# Altium schematic sheet tinybord.SchDoc
size A4
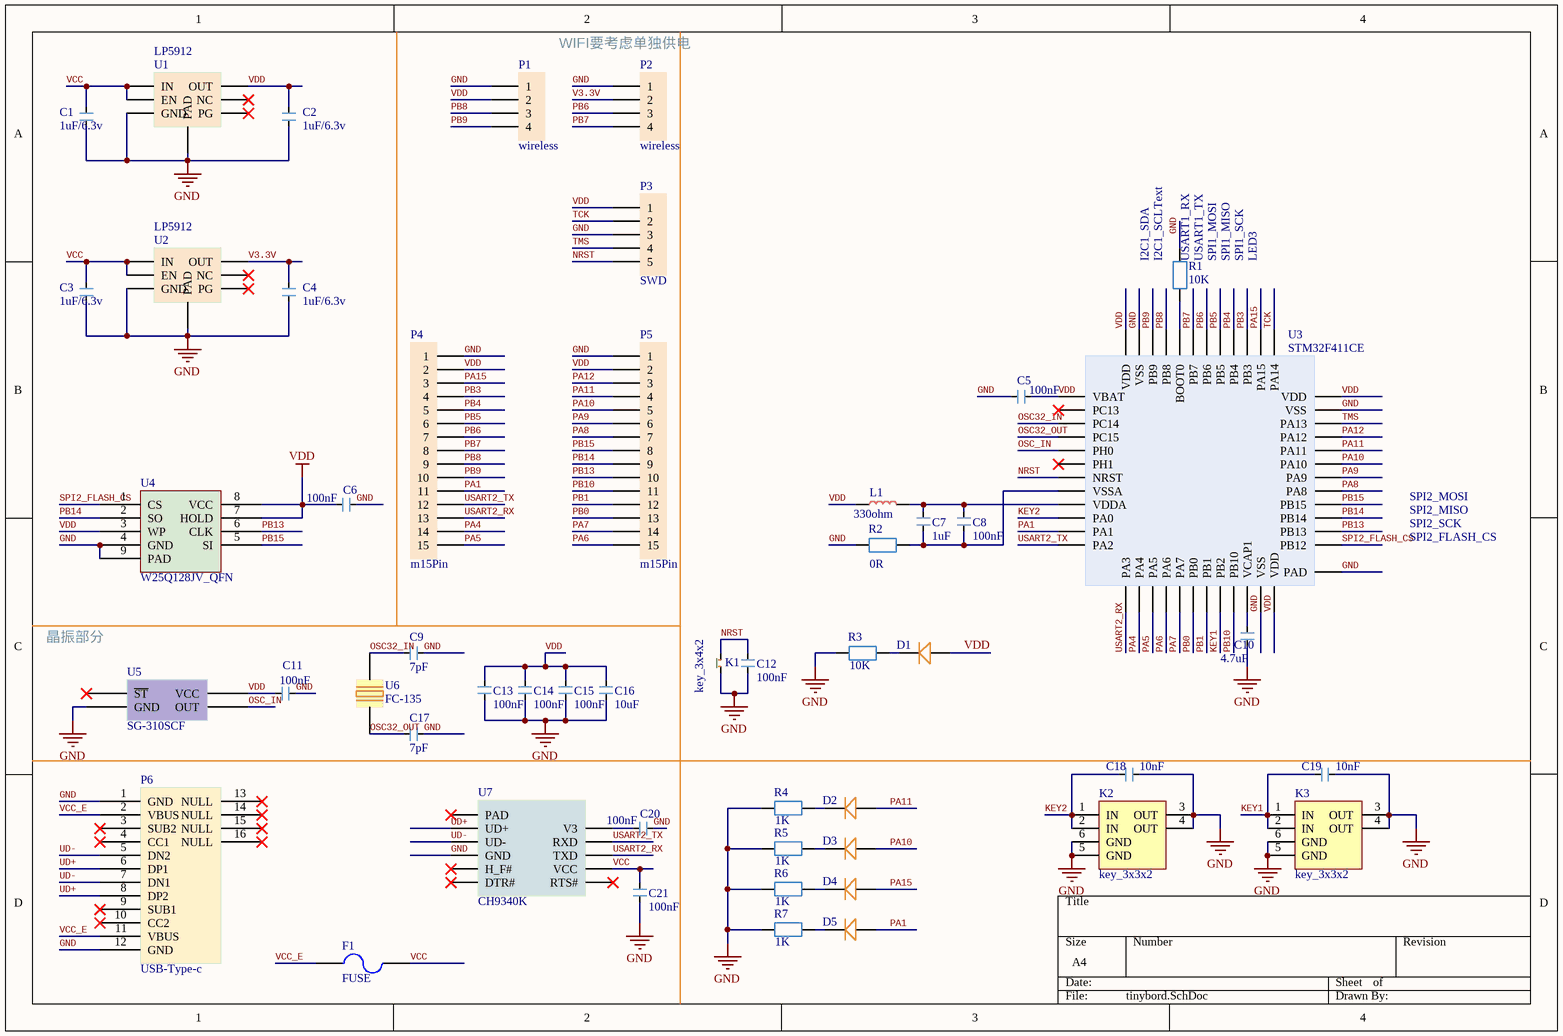
[diagram p0: tinybord.SchDoc]

## Parts
C1  value 1uF/6.3v  [C0603]  (hidden comment: C0603)
C2  value 1uF/6.3v  [C0603]  (hidden comment: C0603)
C3  value 1uF/6.3v  [C0603]  (hidden comment: C0603)
C4  value 1uF/6.3v  [C0603]  (hidden comment: C0603)
C5  value 100nF  [C0603]  (hidden comment: C0603)
C6  value 100nF  [C0603]  (hidden comment: C0603)
C7  value 1uF  [C0603]  (hidden comment: C0603)
C8  value 100nF  [C0603]  (hidden comment: C0603)
C9  value 7pF  [C0603]  (hidden comment: C0603)
C10  value 4.7uF  [C0603]  (hidden comment: C0603)
C11  value 100nF  [C0603]  (hidden comment: C0603)
C12  value 100nF  [C0603]  (hidden comment: C0603)
C13  value 100nF  [C0603]  (hidden comment: C0603)
C14  value 100nF  [C0603]  (hidden comment: C0603)
C15  value 100nF  [C0603]  (hidden comment: C0603)
C16  value 10uF  [C0603]  (hidden comment: C0603)
C17  value 7pF  [C0603]  (hidden comment: C0603)
C18  value 10nF  [C0603]  (hidden comment: C0603)
C19  value 10nF  [C0603]  (hidden comment: C0603)
C20  value 100nF  [C0603]  (hidden comment: C0603)
C21  value 100nF  [C0603]  (hidden comment: C0603)
D1  L0603  [led0603]  (value not drawn)
D2  L0603  [led0603]  (value not drawn)
D3  L0603  [led0603]  (value not drawn)
D4  L0603  [led0603]  (value not drawn)
D5  L0603  [led0603]  (value not drawn)
F1  FUSE  [R0603]
K1  key_3x4x2  [Key 3x4x2]
K2  key_3x3x2  [Key 3x3x2]
K3  key_3x3x2  [Key 3x3x2]
L1  value 330ohm  [B0603]  (hidden comment: B0603)
P1  wireless  [4x1 header]
P2  wireless  [4x1 header]
P3  SWD  [5x1 header]
P4  m15Pin  [15x1 header]
P5  m15Pin  [15x1 header]
P6  USB-Type-c  [USB-TYPE-C]
R1  value 10K  [R0603]  (hidden comment: R0603)
R2  value 0R  [R0603]  (hidden comment: R0603)
R3  value 10K  [R0603]  (hidden comment: R0603)
R4  value 1K  [R0603]  (hidden comment: R0603)
R5  value 1K  [R0603]  (hidden comment: R0603)
R6  value 1K  [R0603]  (hidden comment: R0603)
R7  value 1K  [R0603]  (hidden comment: R0603)
U1  LP5912  [LP5912]
U2  LP5912  [LP5912]
U3  STM32F411CE  [STM32F411CE QFN]
U4  W25Q128JV_QFN  [W25Q64 QFN]
U5  SG-310SCF  [SG-310SCF]
U6  FC-135  [FC-135]
U7  CH9340K  [CH9340]

## Nets
GND: C1.1 C2.1 C3.1 C4.1 C5.1 C6.2 C9.1 C10.1 C11.2 C12.1 C13.1 C14.1 C15.1 C16.1 C17.1 C18.1 C19.1 C20.2 C21.1 K1.1 K2.3(OUT) K2.4(OUT) K2.5(GND) K2.6(GND) K3.3(OUT) K3.4(OUT) K3.5(GND) K3.6(GND) P1.1 P2.1 P3.3 P4.1 P5.1 P6.1(GND) P6.12(GND) R1.2 R2.1 R3.1 R4.1 R5.1 R6.1 R7.1 U1.5(GND) U1.7(PAD) U2.5(GND) U2.7(PAD) U3.23(VSS) U3.35(VSS) U3.47(VSS) U3.49(PAD) U4.4(GND) U4.9(PAD) U5.2(GND) U7.3(GND)
VDD: C2.2 C5.2 C6.1 C11.1 C13.2 C14.2 C15.2 C16.2 D1.2 L1.1 P1.2 P3.1 P4.2 P5.2 U1.1(OUT) U3.1(VBAT) U3.24(VDD) U3.36(VDD) U3.48(VDD) U4.3(WP) U4.7(HOLD) U4.8(VCC) U5.4(VCC)
KEY1: C19.2 K3.1(IN) K3.2(IN) U3.20(PB2)
KEY2: C18.2 K2.1(IN) K2.2(IN) U3.10(PA0)
NRST: C12.2 K1.2 P3.5 U3.7(NRST)
OSC32_IN: C9.2 U3.3(PC14) U6.2
OSC32_OUT: C17.2 U3.4(PC15) U6.1
OSC_IN: U3.5(PH0) U5.3(OUT)
PA1: D5.2 P4.11 U3.11(PA1)
PA4: P4.14 U3.14(PA4)
PA5: P4.15 U3.15(PA5)
PA6: P5.15 U3.16(PA6)
PA7: P5.14 U3.17(PA7)
PA8: P5.7 U3.29(PA8)
PA9: P5.6 U3.30(PA9)
PA10: D3.2 P5.5 U3.31(PA10)
PA11: D2.2 P5.4 U3.32(PA11)
PA12: P5.3 U3.33(PA12)
PA15: D4.2 P4.3 U3.38(PA15)
PB0: P5.13 U3.18(PB0)
PB1: P5.12 U3.19(PB1)
PB3: P4.4 U3.39(PB3)
PB4: P4.5 U3.40(PB4)
PB5: P4.6 U3.41(PB5)
PB6: P2.3 P4.7 U3.42(PB6)
PB7: P2.4 P4.8 U3.43(PB7)
PB8: P1.3 P4.9 U3.45(PB8)
PB9: P1.4 P4.10 U3.46(PB9)
PB10: P5.11 U3.21(PB10)
PB13: P5.10 U3.26(PB13) U4.6(CLK)
PB14: P5.9 U3.27(PB14) U4.2(SO)
PB15: P5.8 U3.28(PB15) U4.5(SI)
SPI2_FLASH_CS: U3.25(PB12) U4.1(CS)
TCK: P3.2 U3.37(PA14)
TMS: P3.4 U3.34(PA13)
UD+: P6.6(DP1) P6.8(DP2) U7.1(UD+)
UD-: P6.5(DN2) P6.7(DN1) U7.2(UD-)
USART2_RX: P4.13 U3.13(PA3) U7.8(TXD)
USART2_TX: P4.12 U3.12(PA2) U7.9(RXD)
V3.3V: C4.2 P2.2 U2.1(OUT)
VCC: C1.2 C3.2 C21.2 F1.2 U1.4(EN) U1.6(IN) U2.4(EN) U2.6(IN) U7.7(VCC)
VCC_E: F1.1 P6.2(VBUS) P6.11(VBUS)
NetC7_1: C7.1 C8.1 R2.2 U3.8(VSSA)
NetC7_2: C7.2 C8.2 L1.2 U3.9(VDDA)
NetC10_2: C10.2 U3.22(VCAP1)
NetC20_1: C20.1 U7.10(V3)
NetD1_1: D1.1 R3.2
NetD2_1: D2.1 R4.2
NetD3_1: D3.1 R5.2
NetD4_1: D4.1 R6.2
NetD5_1: D5.1 R7.2
NetR1_1: R1.1 U3.44(BOOT0)

Not connected (* = marked no-connect by the designer): P6 3(SUB2)* 4(CC1)* 9(SUB1)* 10(CC2)* 13(NULL)* 14(NULL)* 15(NULL)* 16(NULL)*; U1 2(NC)* 3(PG)*; U2 2(NC)* 3(PG)*; U3 2(PC13)* 6(PH1)*; U5 1(~{ST})*; U7 4(H_F#)* 5(DTR#)* 6(RTS#)* 11(PAD)*

## Notes on the sheet
- WIFI要考虑单独供电
- (near R1) I2C1_SDA
- (near R1) I2C1_SCLText
- (near R1) USART1_RX
- (near R1) USART1_TX
- (near R1) SPI1_MOSI
- (near R1) SPI1_MISO
- SPI1_SCK
- LED3
- SPI2_MOSI
- SPI2_MISO
- SPI2_SCK
- SPI2_FLASH_CS
- 晶振部分

## Library data of the parts
C1-C21 = C0603: 陶瓷电容
D1-D5 = L0603: LED
F1 = PTC0603: PTC 1812
K1 = key_3x4x2: 贴片按键
K2 K3 = key_3x3x2: 贴片按键
L1 = B0603: 磁珠
P1 P2 = m4Pin: 1x4pin 1.27mm
P3 = m5Pin: 1x4pin 1.27mm
P4 P5 = m15Pin: 1x4pin 1.27mm
P6 = USB-Type-c: use typec 16p
R1-R7 = R0603: 电阻
U1 U2 = LP5912: LDO
U3 = STM32F411CE: STM32F411 QFN48PIN
U4 = W25Q128JV_QFN: flash
U5 = SG-310SCF: 有源晶振3225
U6 = FC-135: 32.768K无源晶振
U7 = CH9340K: USB转串口